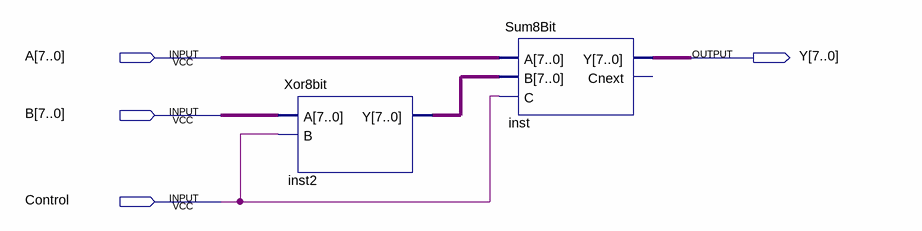
[diagram p0: schematic sheet]
// Quartus schematic SumorSub.bdf as structural Verilog: 2 symbols, 4 pins
module SumorSub (
  input  [7:0] A,
  input  [7:0] B,
  input  Control,
  output [7:0] Y
);

  wire [7:0] inst2_y;

  Xor8bit inst2 (.A(B), .B(Control), .Y(inst2_y));
  Sum8Bit inst (.A(A), .B(inst2_y), .C(Control), .Y(Y));  // open: Cnext
endmodule
